# Altium schematic sheet DO.SchDoc
size A3
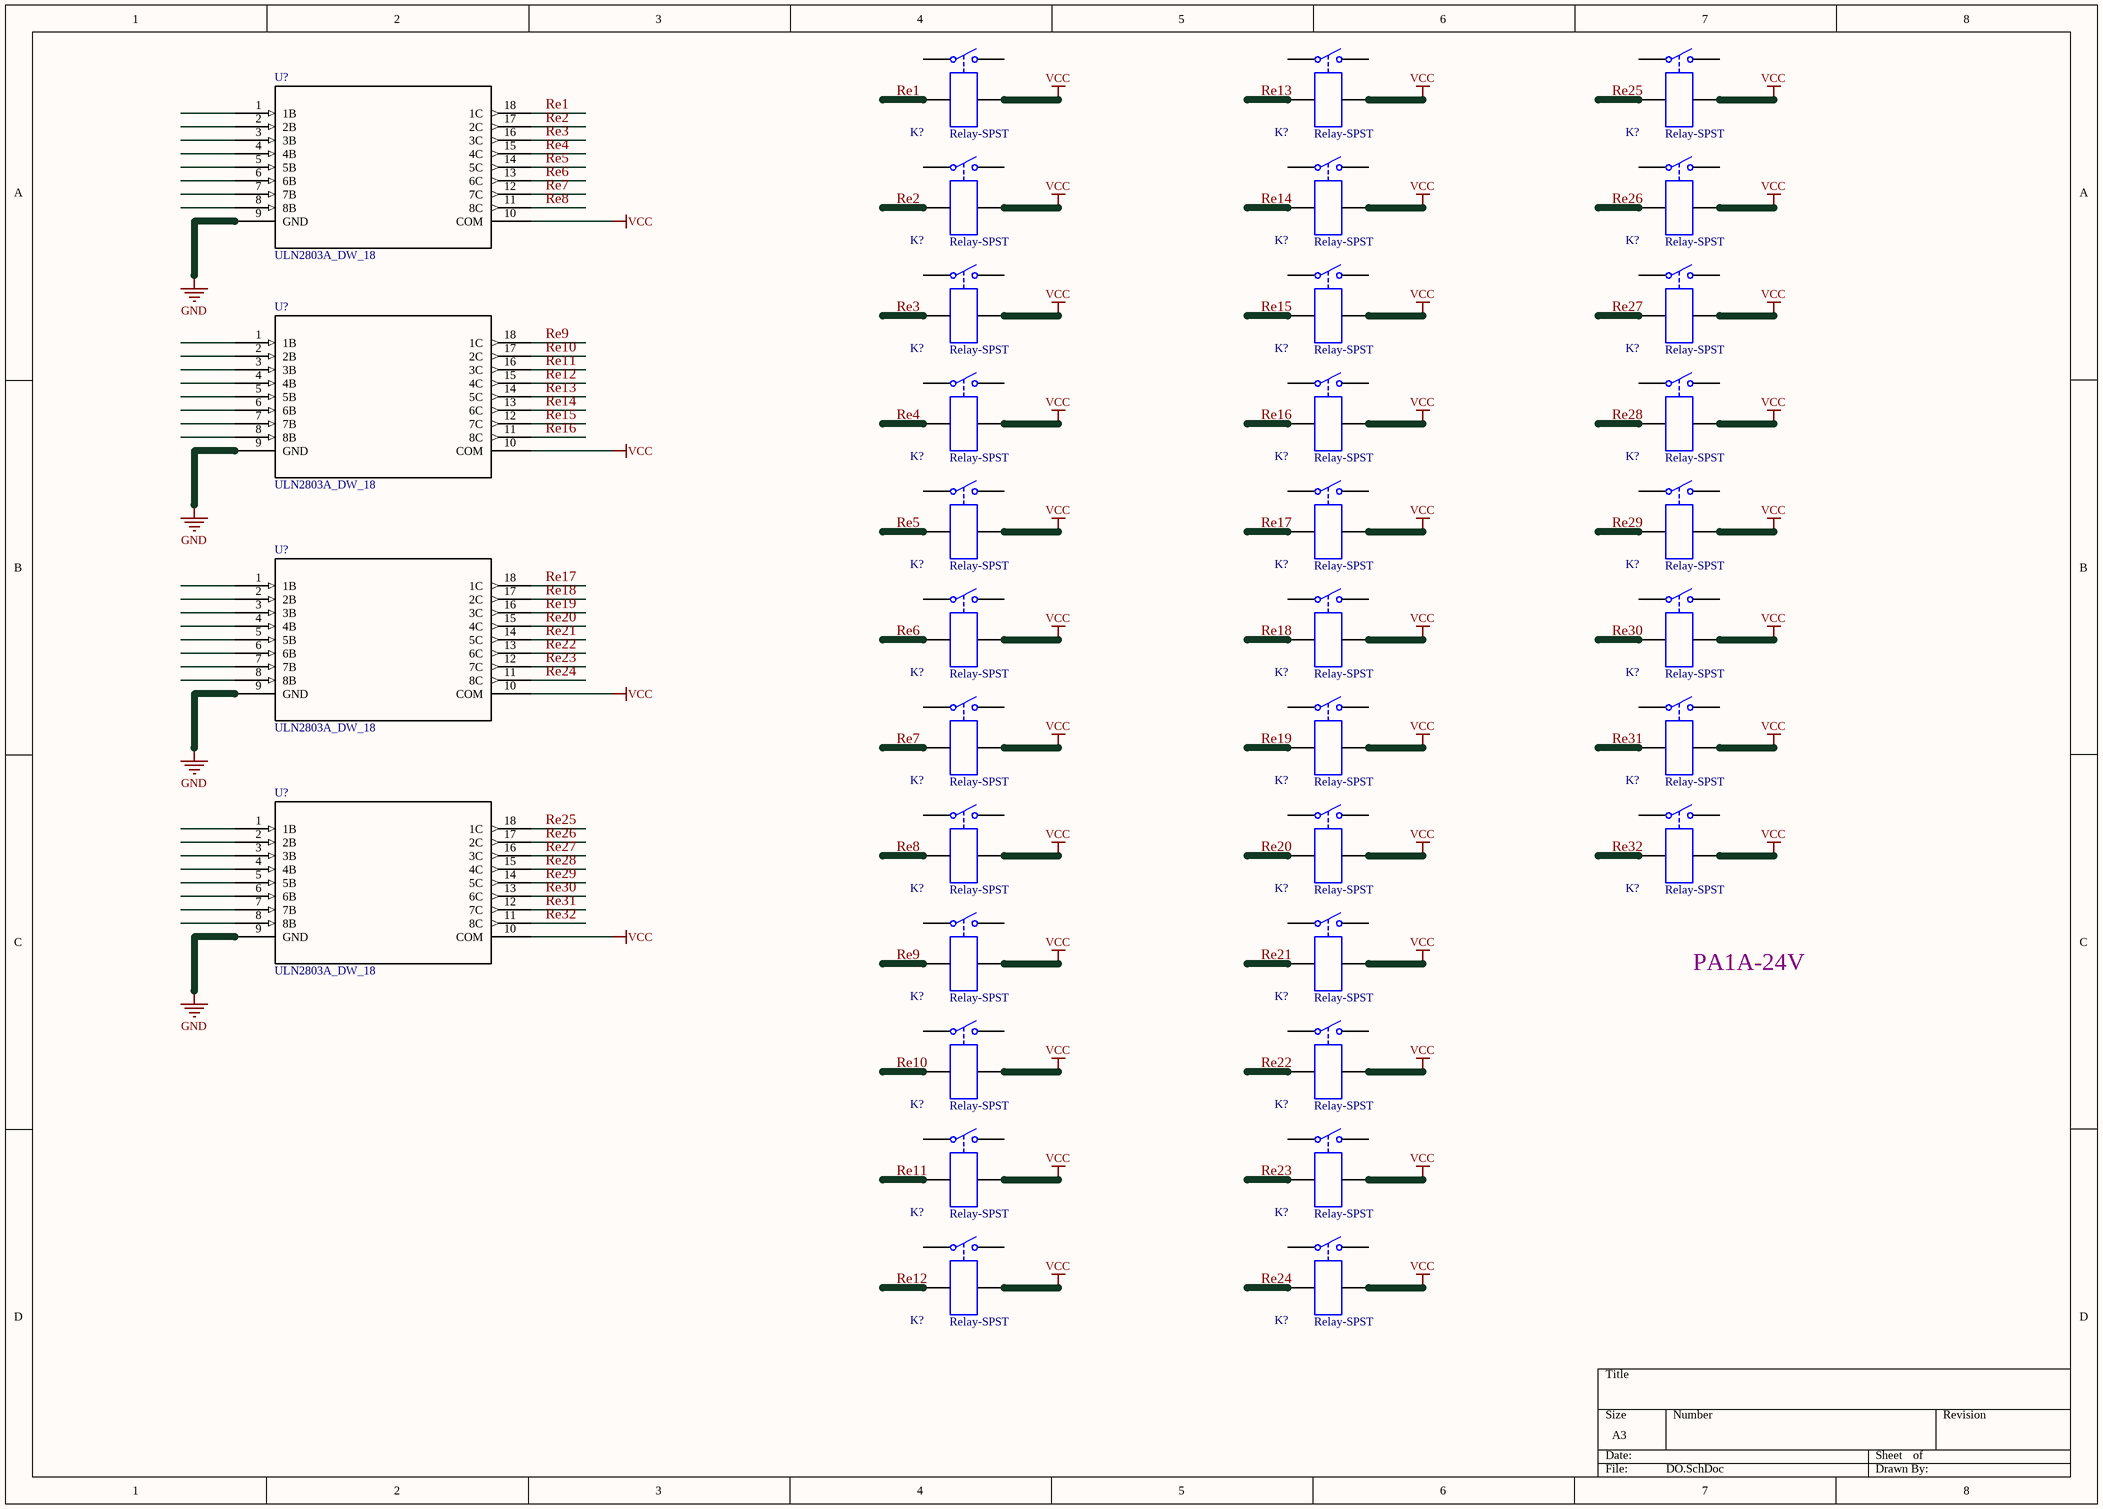
[diagram p0: DO.SchDoc]

## Parts
(Parts that share a designator on the sheet are numbered #1, #2 ... from top to bottom, then left to right.)
K?#1  Relay-SPST  [MODULE4]
K?#2  Relay-SPST  [MODULE4]
K?#3  Relay-SPST  [MODULE4]
K?#4  Relay-SPST  [MODULE4]
K?#5  Relay-SPST  [MODULE4]
K?#6  Relay-SPST  [MODULE4]
K?#7  Relay-SPST  [MODULE4]
K?#8  Relay-SPST  [MODULE4]
K?#9  Relay-SPST  [MODULE4]
K?#10  Relay-SPST  [MODULE4]
K?#11  Relay-SPST  [MODULE4]
K?#12  Relay-SPST  [MODULE4]
K?#13  Relay-SPST  [MODULE4]
K?#14  Relay-SPST  [MODULE4]
K?#15  Relay-SPST  [MODULE4]
K?#16  Relay-SPST  [MODULE4]
K?#17  Relay-SPST  [MODULE4]
K?#18  Relay-SPST  [MODULE4]
K?#19  Relay-SPST  [MODULE4]
K?#20  Relay-SPST  [MODULE4]
K?#21  Relay-SPST  [MODULE4]
K?#22  Relay-SPST  [MODULE4]
K?#23  Relay-SPST  [MODULE4]
K?#24  Relay-SPST  [MODULE4]
K?#25  Relay-SPST  [MODULE4]
K?#26  Relay-SPST  [MODULE4]
K?#27  Relay-SPST  [MODULE4]
K?#28  Relay-SPST  [MODULE4]
K?#29  Relay-SPST  [MODULE4]
K?#30  Relay-SPST  [MODULE4]
K?#31  Relay-SPST  [MODULE4]
K?#32  Relay-SPST  [MODULE4]
U?#1  ULN2803A_DW_18  [DW18]
U?#2  ULN2803A_DW_18  [DW18]
U?#3  ULN2803A_DW_18  [DW18]
U?#4  ULN2803A_DW_18  [DW18]

## Nets
GND: U?#1.9(GND) U?#2.9(GND) U?#3.9(GND) U?#4.9(GND)
VCC: K?#1.4 K?#2.4 K?#3.4 K?#4.4 K?#5.4 K?#6.4 K?#7.4 K?#8.4 K?#9.4 K?#10.4 K?#11.4 K?#12.4 K?#13.4 K?#14.4 K?#15.4 K?#16.4 K?#17.4 K?#18.4 K?#19.4 K?#20.4 K?#21.4 K?#22.4 K?#23.4 K?#24.4 K?#25.4 K?#26.4 K?#27.4 K?#28.4 K?#29.4 K?#30.4 K?#31.4 K?#32.4 U?#1.10(COM) U?#2.10(COM) U?#3.10(COM) U?#4.10(COM)
Re1: K?#1.3 U?#1.18(1C)
Re2: K?#4.3 U?#1.17(2C)
Re3: K?#7.3 U?#1.16(3C)
Re4: K?#10.3 U?#1.15(4C)
Re5: K?#13.3 U?#1.14(5C)
Re6: K?#16.3 U?#1.13(6C)
Re7: K?#19.3 U?#1.12(7C)
Re8: K?#22.3 U?#1.11(8C)
Re9: K?#25.3 U?#2.18(1C)
Re10: K?#27.3 U?#2.17(2C)
Re11: K?#29.3 U?#2.16(3C)
Re12: K?#31.3 U?#2.15(4C)
Re13: K?#2.3 U?#2.14(5C)
Re14: K?#5.3 U?#2.13(6C)
Re15: K?#8.3 U?#2.12(7C)
Re16: K?#11.3 U?#2.11(8C)
Re17: K?#14.3 U?#3.18(1C)
Re18: K?#17.3 U?#3.17(2C)
Re19: K?#20.3 U?#3.16(3C)
Re20: K?#23.3 U?#3.15(4C)
Re21: K?#26.3 U?#3.14(5C)
Re22: K?#28.3 U?#3.13(6C)
Re23: K?#30.3 U?#3.12(7C)
Re24: K?#32.3 U?#3.11(8C)
Re25: K?#3.3 U?#4.18(1C)
Re26: K?#6.3 U?#4.17(2C)
Re27: K?#9.3 U?#4.16(3C)
Re28: K?#12.3 U?#4.15(4C)
Re29: K?#15.3 U?#4.14(5C)
Re30: K?#18.3 U?#4.13(6C)
Re31: K?#21.3 U?#4.12(7C)
Re32: K?#24.3 U?#4.11(8C)

Not connected (* = marked no-connect by the designer): K?#1 1 2; K?#2 1 2; K?#3 1 2; K?#4 1 2; K?#5 1 2; K?#6 1 2; K?#7 1 2; K?#8 1 2; K?#9 1 2; K?#10 1 2; K?#11 1 2; K?#12 1 2; K?#13 1 2; K?#14 1 2; K?#15 1 2; K?#16 1 2; K?#17 1 2; K?#18 1 2; K?#19 1 2; K?#20 1 2; K?#21 1 2; K?#22 1 2; K?#23 1 2; K?#24 1 2; K?#25 1 2; K?#26 1 2; K?#27 1 2; K?#28 1 2; K?#29 1 2; K?#30 1 2; K?#31 1 2; K?#32 1 2; U?#1 1(1B) 2(2B) 3(3B) 4(4B) 5(5B) 6(6B) 7(7B) 8(8B); U?#2 1(1B) 2(2B) 3(3B) 4(4B) 5(5B) 6(6B) 7(7B) 8(8B); U?#3 1(1B) 2(2B) 3(3B) 4(4B) 5(5B) 6(6B) 7(7B) 8(8B); U?#4 1(1B) 2(2B) 3(3B) 4(4B) 5(5B) 6(6B) 7(7B) 8(8B)

## Notes on the sheet
- PA1A-24V

## Library data of the parts
K?#1-K?#32 = Relay-SPST: Single-Pole Single-Throw Relay; Published: 24-Mar-1999; LatestRevisionDate: 17-Jul-2002; LatestRevisionNote: Re-released for DXP Platform.; PackageReference: MODULE4; Publisher: Altium Limited
U?#1-U?#4 = ULN2803A_DW_18: Imported; Manufacturer: Texas Instruments; INDUSTRY_STD_PKG_TYPE: SOIC; FAMILY_NAME: PERIPHERAL DRIVER AND ACTUATOR; PIN_COUNT: 18; PACKAGE_DESIGNATOR: DW; Datasheet URL: http://www.ti.com/lit/gpn/ULN2803A; GENERIC_PART_NUMBER: ULN2803A; RefDes: RefDes; Type: DEV; Value: Value